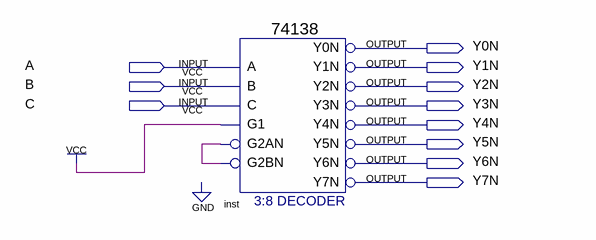
[diagram p0: schematic sheet]
// Quartus schematic ttl74138.bdf as structural Verilog: 1 symbols, 11 pins
module ttl74138 (
  input  A,
  input  B,
  input  C,
  output Y0N,
  output Y1N,
  output Y2N,
  output Y3N,
  output Y4N,
  output Y5N,
  output Y6N,
  output Y7N
);

  wire undriven;

  \74138  inst (
    .A(A), .B(B), .G1(1'b1), .C(C), .G2AN(undriven), .G2BN(undriven), .Y0N(Y0N), .Y1N(Y1N), .Y2N(Y2N),
    .Y3N(Y3N), .Y4N(Y4N), .Y5N(Y5N), .Y6N(Y6N), .Y7N(Y7N));
endmodule
